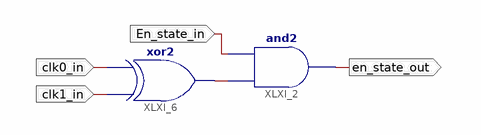
[diagram p0: schematic sheet 1]
// Xilinx ISE schematic snaggle_tx.sch (spartan3e) as structural Verilog: 2 symbols, 4 ports
module snaggle_tx (
  input  clk0_in,
  input  clk1_in,
  input  En_state_in,
  output en_state_out
);

  wire XLXN_3;

  and XLXI_2 (en_state_out, XLXN_3, En_state_in);
  xor XLXI_6 (XLXN_3, clk1_in, clk0_in);
endmodule
